# Altium project ControlBoard.PrjPcb
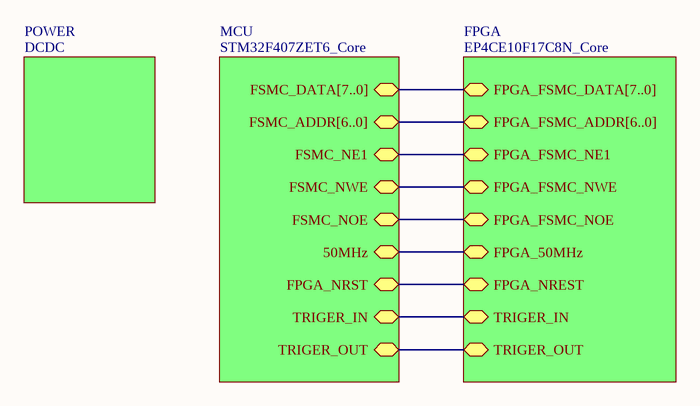
[diagram p0: Top.SchDoc]
4 sheets, 133 parts. Net scope: hierarchical (ports join the sheet entries above them; power ports are global).
Board file: ControlBoard.PcbDoc
Sheets:
  Top.SchDoc
    MCU = STM32F407ZET6_Core.SchDoc
    FPGA = EP4CE10F17C8N_Core.SchDoc
    POWER = DCDC.SchDoc

## Sheet Top.SchDoc
size A4; SheetNumber: 1; SheetTotal: 4

### Sub-sheets
FPGA = EP4CE10F17C8N_Core: FPGA_FSMC_DATA[7..0] (bidir), FPGA_50MHz (bidir), FPGA_FSMC_ADDR[6..0] (bidir), FPGA_NREST (bidir), FPGA_FSMC_NE1 (bidir), FPGA_FSMC_NWE (bidir), FPGA_FSMC_NOE (bidir), TRIGER_IN (bidir), TRIGER_OUT (bidir)
MCU = STM32F407ZET6_Core: FSMC_DATA[7..0] (bidir), 50MHz (bidir), FSMC_ADDR[6..0] (bidir), FPGA_NRST (bidir), FSMC_NE1 (bidir), FSMC_NWE (bidir), FSMC_NOE (bidir), TRIGER_IN (bidir), TRIGER_OUT (bidir)
POWER = DCDC: no entries

### Nets
FPGA_25MHZ: sheet MCU/50MHz, sheet FPGA/FPGA_50MHz
FPGA_NRST: sheet MCU/FPGA_NRST, sheet FPGA/FPGA_NREST
FSMC_NE1: sheet MCU/FSMC_NE1, sheet FPGA/FPGA_FSMC_NE1
FSMC_NOE: sheet MCU/FSMC_NOE, sheet FPGA/FPGA_FSMC_NOE
FSMC_NWE: sheet MCU/FSMC_NWE, sheet FPGA/FPGA_FSMC_NWE
TRIGER_IN: sheet MCU/TRIGER_IN, sheet FPGA/TRIGER_IN
TRIGER_OUT: sheet MCU/TRIGER_OUT, sheet FPGA/TRIGER_OUT

### Buses and harness runs
bus sheet FPGA/FPGA_FSMC_ADDR[6..0] = sheet MCU/FSMC_ADDR[6..0]
bus sheet FPGA/FPGA_FSMC_DATA[7..0] = sheet MCU/FSMC_DATA[7..0]

## Sheet STM32F407ZET6_Core.SchDoc
size A3; SheetNumber: 2; SheetTotal: 4
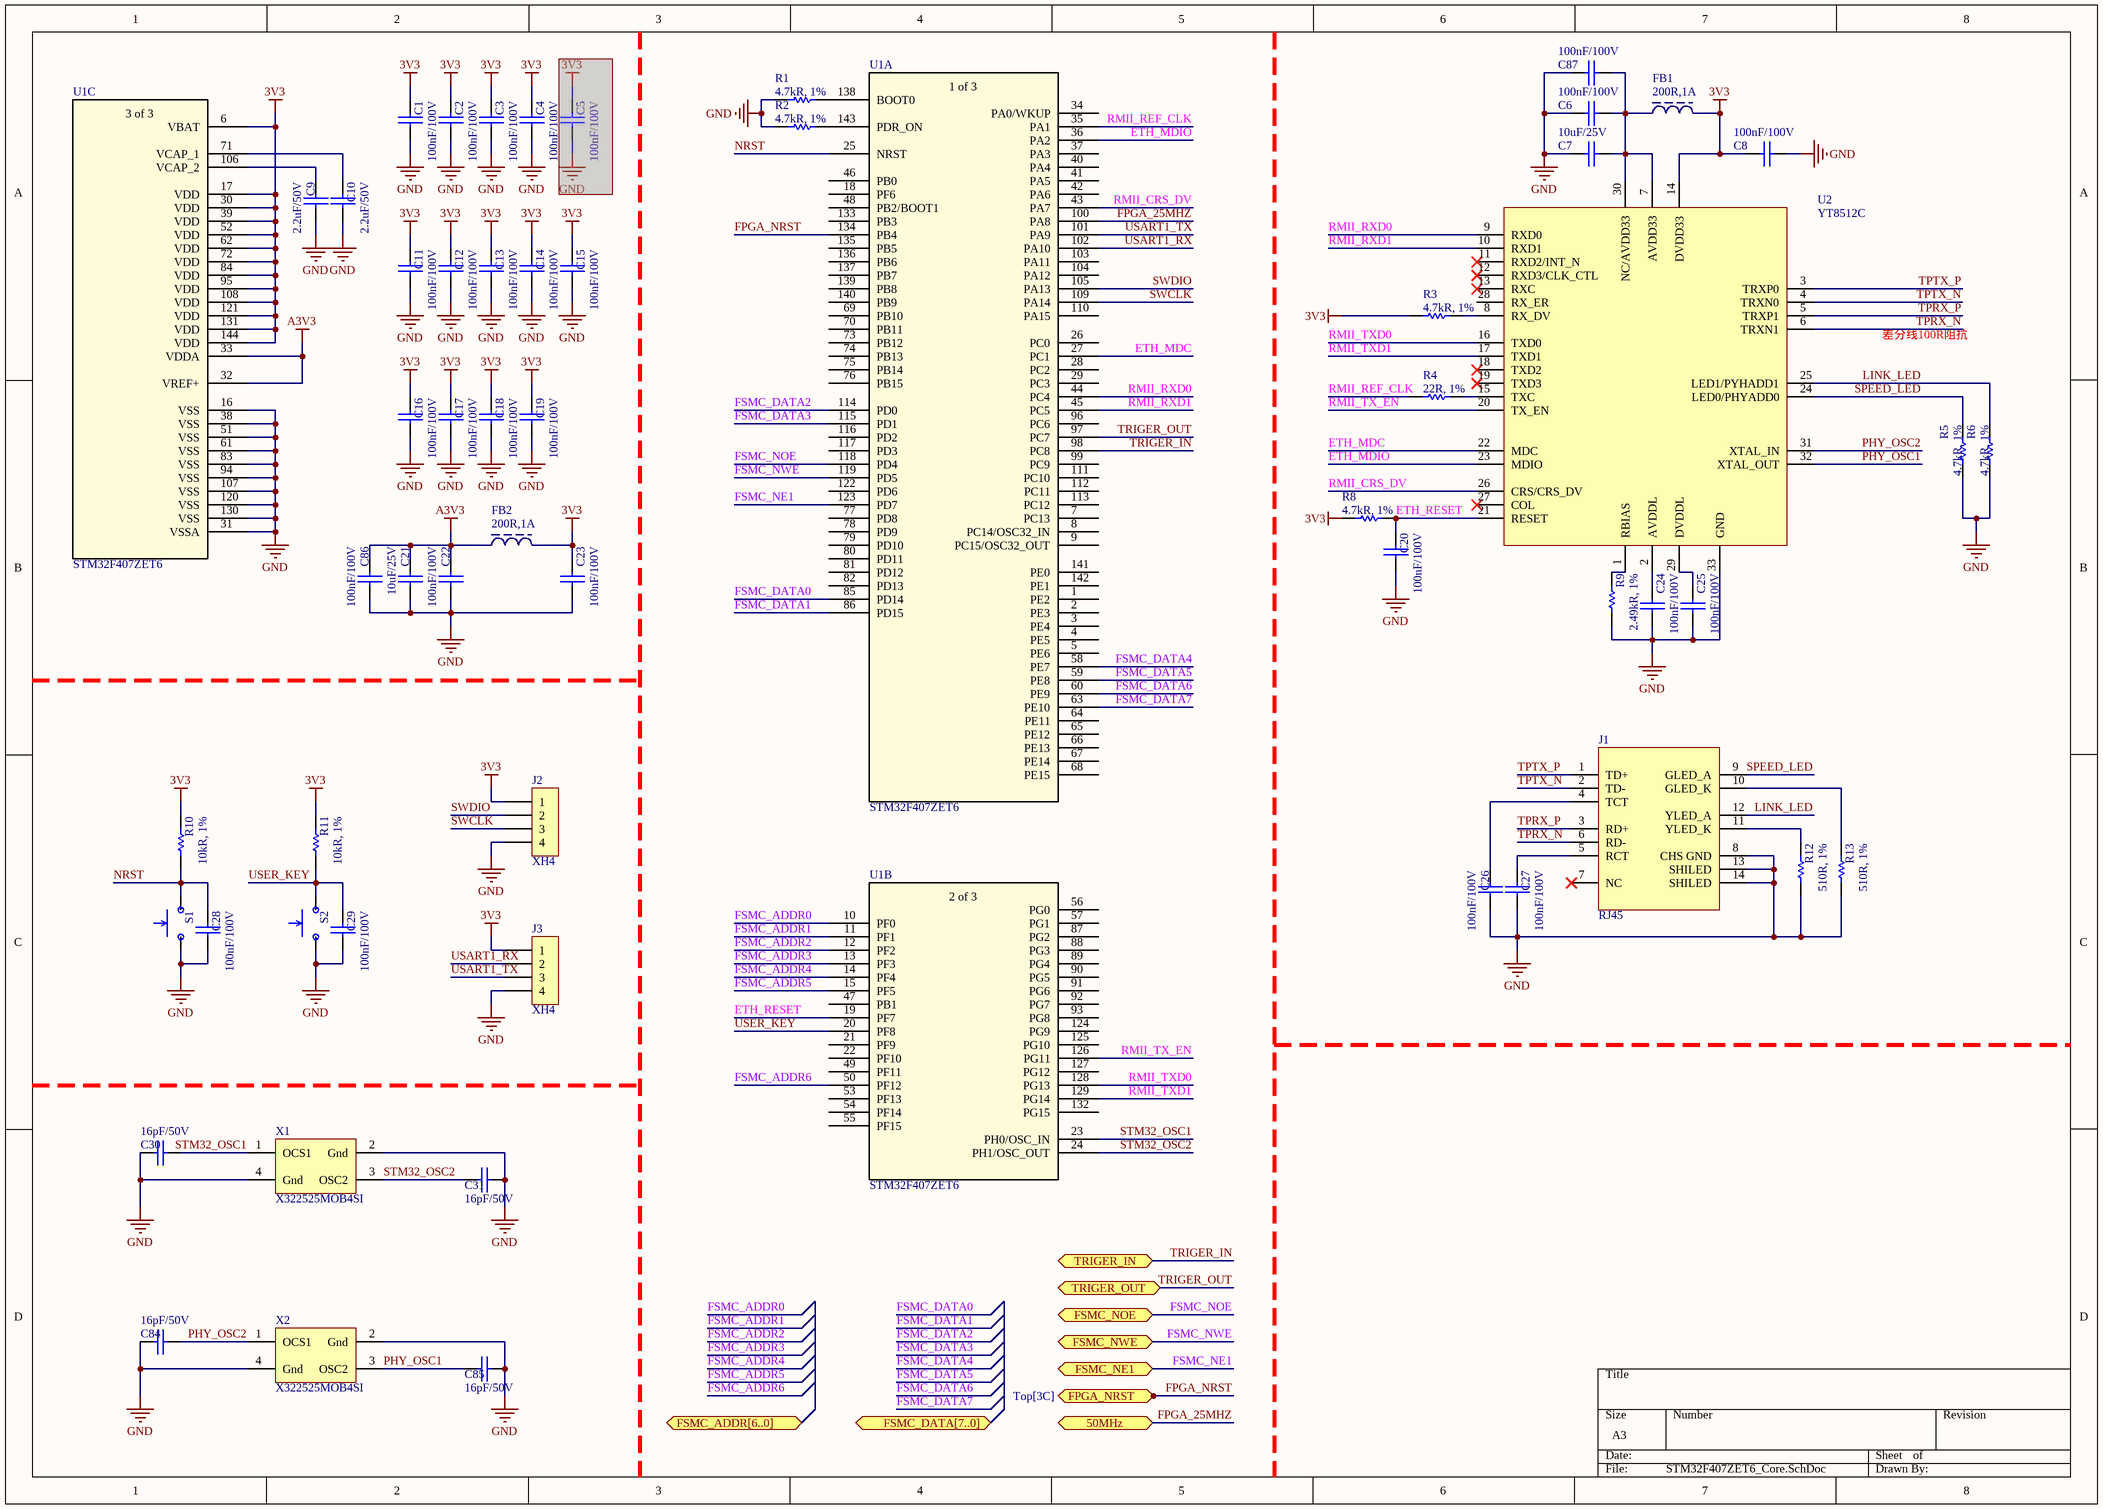
[diagram p1: STM32F407ZET6_Core.SchDoc]

### Parts
C1  100nF/100V  [0603C]
C2  100nF/100V  [0603C]
C3  100nF/100V  [0603C]
C4  100nF/100V  [0603C]
C5  100nF/100V  [0603C]  (masked out: inside a compile mask, not in the netlist)
C6  100nF/100V  [0603C]
C7  10uF/25V  [0603C]
C8  100nF/100V  [0603C]
C9  2.2uF/50V  [0603C]
C10  2.2uF/50V  [0603C]
C11  100nF/100V  [0603C]
C12  100nF/100V  [0603C]
C13  100nF/100V  [0603C]
C14  100nF/100V  [0603C]
C15  100nF/100V  [0603C]
C16  100nF/100V  [0603C]
C17  100nF/100V  [0603C]
C18  100nF/100V  [0603C]
C19  100nF/100V  [0603C]
C20  100nF/100V  [0603C]
C21  10uF/25V  [0603C]
C22  100nF/100V  [0603C]
C23  100nF/100V  [0603C]
C24  100nF/100V  [0603C]
C25  100nF/100V  [0603C]
C26  100nF/100V  [0603C]
C27  100nF/100V  [0603C]
C28  100nF/100V  [0603C]
C29  100nF/100V  [0603C]
C30  16pF/50V  [0603C]
C31  16pF/50V  [0603C]
C84  16pF/50V  [0603C]
C85  16pF/50V  [0603C]
C86  100nF/100V  [0603C]
C87  100nF/100V  [0603C]
FB1  200R,1A  [0603]
FB2  200R,1A  [0603]
J1  RJ45  [1105A_HAN]
J2  XH4  [XH4/2.54mm/180]
J3  XH4  [XH4/2.54mm/180]
R1  4.7kR, 1%  [0603R]
R2  4.7kR, 1%  [0603R]
R3  4.7kR, 1%  [0603R]
R4  22R, 1%  [0603R]
R5  4.7kR, 1%  [0603R]
R6  4.7kR, 1%  [0603R]
R8  4.7kR, 1%  [0603R]
R9  2.49kR, 1%  [0603R]
R10  10kR, 1%  [0603R]
R11  10kR, 1%  [0603R]
R12  510R, 1%  [0603R]
R13  510R, 1%  [0603R]
S1  Key  [SW-SMD]  (value not drawn)
S2  Key  [SW-SMD]  (value not drawn)
U1  STM32F407ZET6  [LQFP144-20x20mm]  (parts A,B,C of 3)
U2  YT8512C  [QFN32]
X1  X322525MOB4SI  [SMD3225-4]
X2  X322525MOB4SI  [SMD3225-4]

### Ports
50MHz (bidir, see Top[3C]), FPGA_NRST (bidir, see Top[3C]), FSMC_ADDR[6..0] (bidir, see Top[3B]), FSMC_DATA[7..0] (bidir, see Top[3B]), FSMC_NE1 (bidir, see Top[3B]), FSMC_NOE (bidir, see Top[3B]), FSMC_NWE (bidir, see Top[3B]), TRIGER_IN (bidir, see Top[3C], EP4CE10F17C8N_Core[6A]), TRIGER_OUT (bidir, see Top[3C], EP4CE10F17C8N_Core[6A])

### Nets
3V3: C1.2 C2.2 C3.2 C4.2 C8.2 C11.2 C12.2 C13.2 C14.2 C15.2 C16.2 C17.2 C18.2 C19.2 C23.2 FB1.2 FB2.2 J2.1 J3.1 R3.1 R8.1 R10.1 R11.1 U1.6(VBAT) U1.17(VDD) U1.30(VDD) U1.39(VDD) U1.52(VDD) U1.62(VDD) U1.72(VDD) U1.84(VDD) U1.95(VDD) U1.108(VDD) U1.121(VDD) U1.131(VDD) U1.144(VDD) U2.14(DVDD33)
A3V3: C21.1 C22.2 C86.2 FB2.1 U1.32(VREF+) U1.33(VDDA)
GND: C1.1 C2.1 C3.1 C4.1 C6.2 C7.2 C8.1 C9.2 C10.2 C11.1 C12.1 C13.1 C14.1 C15.1 C16.1 C17.1 C18.1 C19.1 C20.2 C21.2 C22.1 C23.1 C24.2 C25.2 C26.1 C27.2 C28.1 C29.1 C30.1 C31.2 C84.1 C85.2 C86.1 C87.2 J1.8(CHS_GND) J1.13(SHILED) J1.14(SHILED) J2.4 J3.4 R1.1 R2.1 R5.2 R6.2 R9.1 R12.2 R13.2 S1.1 S2.1 U1.16(VSS) U1.31(VSSA) U1.38(VSS) U1.51(VSS) U1.61(VSS) U1.83(VSS) U1.94(VSS) U1.107(VSS) U1.120(VSS) U1.130(VSS) U2.33(GND) X1.2(Gnd) X1.4(Gnd) X2.2(Gnd) X2.4(Gnd)
ETH_MDC: U1.27(PC1) U2.22(MDC)
ETH_MDIO: U1.36(PA2) U2.23(MDIO)
ETH_RESET: C20.1 R8.2 U1.19(PF7) U2.21(RESET)
FPGA_25MHZ: U1.100(PA8) ; port 50MHz
FPGA_NRST: U1.134(PB4) ; port FPGA_NRST
FSMC_ADDR0: U1.10(PF0)
FSMC_ADDR1: U1.11(PF1)
FSMC_ADDR2: U1.12(PF2)
FSMC_ADDR3: U1.13(PF3)
FSMC_ADDR4: U1.14(PF4)
FSMC_ADDR5: U1.15(PF5)
FSMC_ADDR6: U1.50(PF12)
FSMC_DATA0: U1.85(PD14)
FSMC_DATA1: U1.86(PD15)
FSMC_DATA2: U1.114(PD0)
FSMC_DATA3: U1.115(PD1)
FSMC_DATA4: U1.58(PE7)
FSMC_DATA5: U1.59(PE8)
FSMC_DATA6: U1.60(PE9)
FSMC_DATA7: U1.63(PE10)
FSMC_NE1: U1.123(PD7) ; port FSMC_NE1
FSMC_NOE: U1.118(PD4) ; port FSMC_NOE
FSMC_NWE: U1.119(PD5) ; port FSMC_NWE
LINK_LED: J1.12(YLED_A) R6.1 U2.25(LED1/PYHADD1)
NRST: C28.2 R10.2 S1.2 U1.25(NRST)
PHY_OSC1: C85.1 U2.32(XTAL_OUT) X2.3(OSC2)
PHY_OSC2: C84.2 U2.31(XTAL_IN) X2.1(OCS1)
RMII_CRS_DV: U1.43(PA7) U2.26(CRS/CRS_DV)
RMII_REF_CLK: R4.1 U1.35(PA1)
RMII_RXD0: U1.44(PC4) U2.9(RXD0)
RMII_RXD1: U1.45(PC5) U2.10(RXD1)
RMII_TX_EN: U1.126(PG11) U2.20(TX_EN)
RMII_TXD0: U1.128(PG13) U2.16(TXD0)
RMII_TXD1: U1.129(PG14) U2.17(TXD1)
SPEED_LED: J1.9(GLED_A) R5.1 U2.24(LED0/PHYADD0)
STM32_OSC1: C30.2 U1.23(PH0/OSC_IN) X1.1(OCS1)
STM32_OSC2: C31.1 U1.24(PH1/OSC_OUT) X1.3(OSC2)
SWCLK: J2.3 U1.109(PA14)
SWDIO: J2.2 U1.105(PA13)
TPRX_N: J1.6(RD-) U2.6(TRXN1)
TPRX_P: J1.3(RD+) U2.5(TRXP1)
TPTX_N: J1.2(TD-) U2.4(TRXN0)
TPTX_P: J1.1(TD+) U2.3(TRXP0)
TRIGER_IN: U1.98(PC8) ; port TRIGER_IN
TRIGER_OUT: U1.97(PC7) ; port TRIGER_OUT
USART1_RX: J3.2 U1.102(PA10)
USART1_TX: J3.3 U1.101(PA9)
USER_KEY: C29.2 R11.2 S2.2 U1.20(PF8)
NetC6_1: C6.1 C7.1 C87.1 FB1.1 U2.7(AVDD33) U2.30(NC/AVDD33)
NetC9_1: C9.1 U1.106(VCAP_2)
NetC10_1: C10.1 U1.71(VCAP_1)
NetC24_1: C24.1 U2.2(AVDDL)
NetC25_1: C25.1 U2.29(DVDDL)
NetC26_2: C26.2 J1.4(TCT)
NetC27_1: C27.1 J1.5(RCT)
NetJ1_10: J1.10(GLED_K) R13.1
NetJ1_11: J1.11(YLED_K) R12.1
NetR1_2: R1.2 U1.138(BOOT0)
NetR2_2: R2.2 U1.143(PDR_ON)
NetR3_2: R3.2 U2.8(RX_DV)
NetR4_2: R4.2 U2.15(TXC)
NetR9_2: R9.2 U2.1(RBIAS)

Not connected (* = marked no-connect by the designer): J1 7(NC)*; U1 1(PE2) 2(PE3) 3(PE4) 4(PE5) 5(PE6) 7(PC13) 8(PC14/OSC32_IN) 9(PC15/OSC32_OUT) 18(PF6) 21(PF9) 22(PF10) 26(PC0) 28(PC2) 29(PC3) 34(PA0/WKUP) 37(PA3) 40(PA4) 41(PA5) 42(PA6) 46(PB0) 47(PB1) 48(PB2/BOOT1) 49(PF11) 53(PF13) 54(PF14) 55(PF15) 56(PG0) 57(PG1) 64(PE11) 65(PE12) 66(PE13) 67(PE14) 68(PE15) 69(PB10) 70(PB11) 73(PB12) 74(PB13) 75(PB14) 76(PB15) 77(PD8) 78(PD9) 79(PD10) 80(PD11) 81(PD12) 82(PD13) 87(PG2) 88(PG3) 89(PG4) 90(PG5) 91(PG6) 92(PG7) 93(PG8) 96(PC6) 99(PC9) 103(PA11) 104(PA12) 110(PA15) 111(PC10) 112(PC11) 113(PC12) 116(PD2) 117(PD3) 122(PD6) 124(PG9) 125(PG10) 127(PG12) 132(PG15) 133(PB3) 135(PB5) 136(PB6) 137(PB7) 139(PB8) 140(PB9) 141(PE0) 142(PE1); U2 11(RXD2/INT_N)* 12(RXD3/CLK_CTL)* 13(RXC)* 18(TXD2)* 19(TXD3)* 27(COL)* 28(RX_ER)

### Notes on the sheet
- 差分线100R阻抗
- (in symbol STM32F407ZET6, part A) 1 of 3
- (in symbol STM32F407ZET6, part B) 2 of 3
- (in symbol STM32F407ZET6, part C) 3 of 3

### Library data of the parts
C1-C6 C8 C11-C20 C22-C29 C86 C87 = CAP: CC0603KRX7R9BB104
C7 C21 = CAP: CC0603MRX5R8BB106
C9 C10 = CAP: CC0603KRX5R9BB225
C30 C31 C84 C85 = CAP: CC0603FRNPO9BN160
FB1 FB2 = 磁珠_1: PZ1608D201-1R0TF
J1 = RJ45: HR911105A HANREN
J2 J3 = XH4: ZX-XH2.54-4PZZ
R1-R3 R5 R6 R8 = RES: RC0603FR-074K7L
R4 = RES: RC0603FR-0722RL
R9 = RES: RC0603FR-072K49L
R10 R11 = RES: AC0603FR-0710KL
R12 R13 = RES: RC0603FR-07510RL
S1 S2 = SW: TS-1101-C-W
U1 = STM32F407ZET6: High-performance foundation line, Arm Cortex-M4 core with DSP and FPU, 512 Kbytes of Flash memory, 168 MHz CPU, ART Accelerator, Ethernet, FSMC; Manufacturer_Name: STMicroelectronics; Copyright: Copyright (C) 2025 Ultra Librarian. All rights reserved.; Manufacturer_Part_Number: STM32F407ZET6; Datasheet: https://www.st.com/resource/en/datasheet/stm32f405rg.pdf; RefDes: RefDes; Type: Type
U2 = YT8512C: PHY
X1 X2 = DSX321G-16M: 无源晶振

## Sheet EP4CE10F17C8N_Core.SchDoc
size A3; SheetNumber: 3; SheetTotal: 4
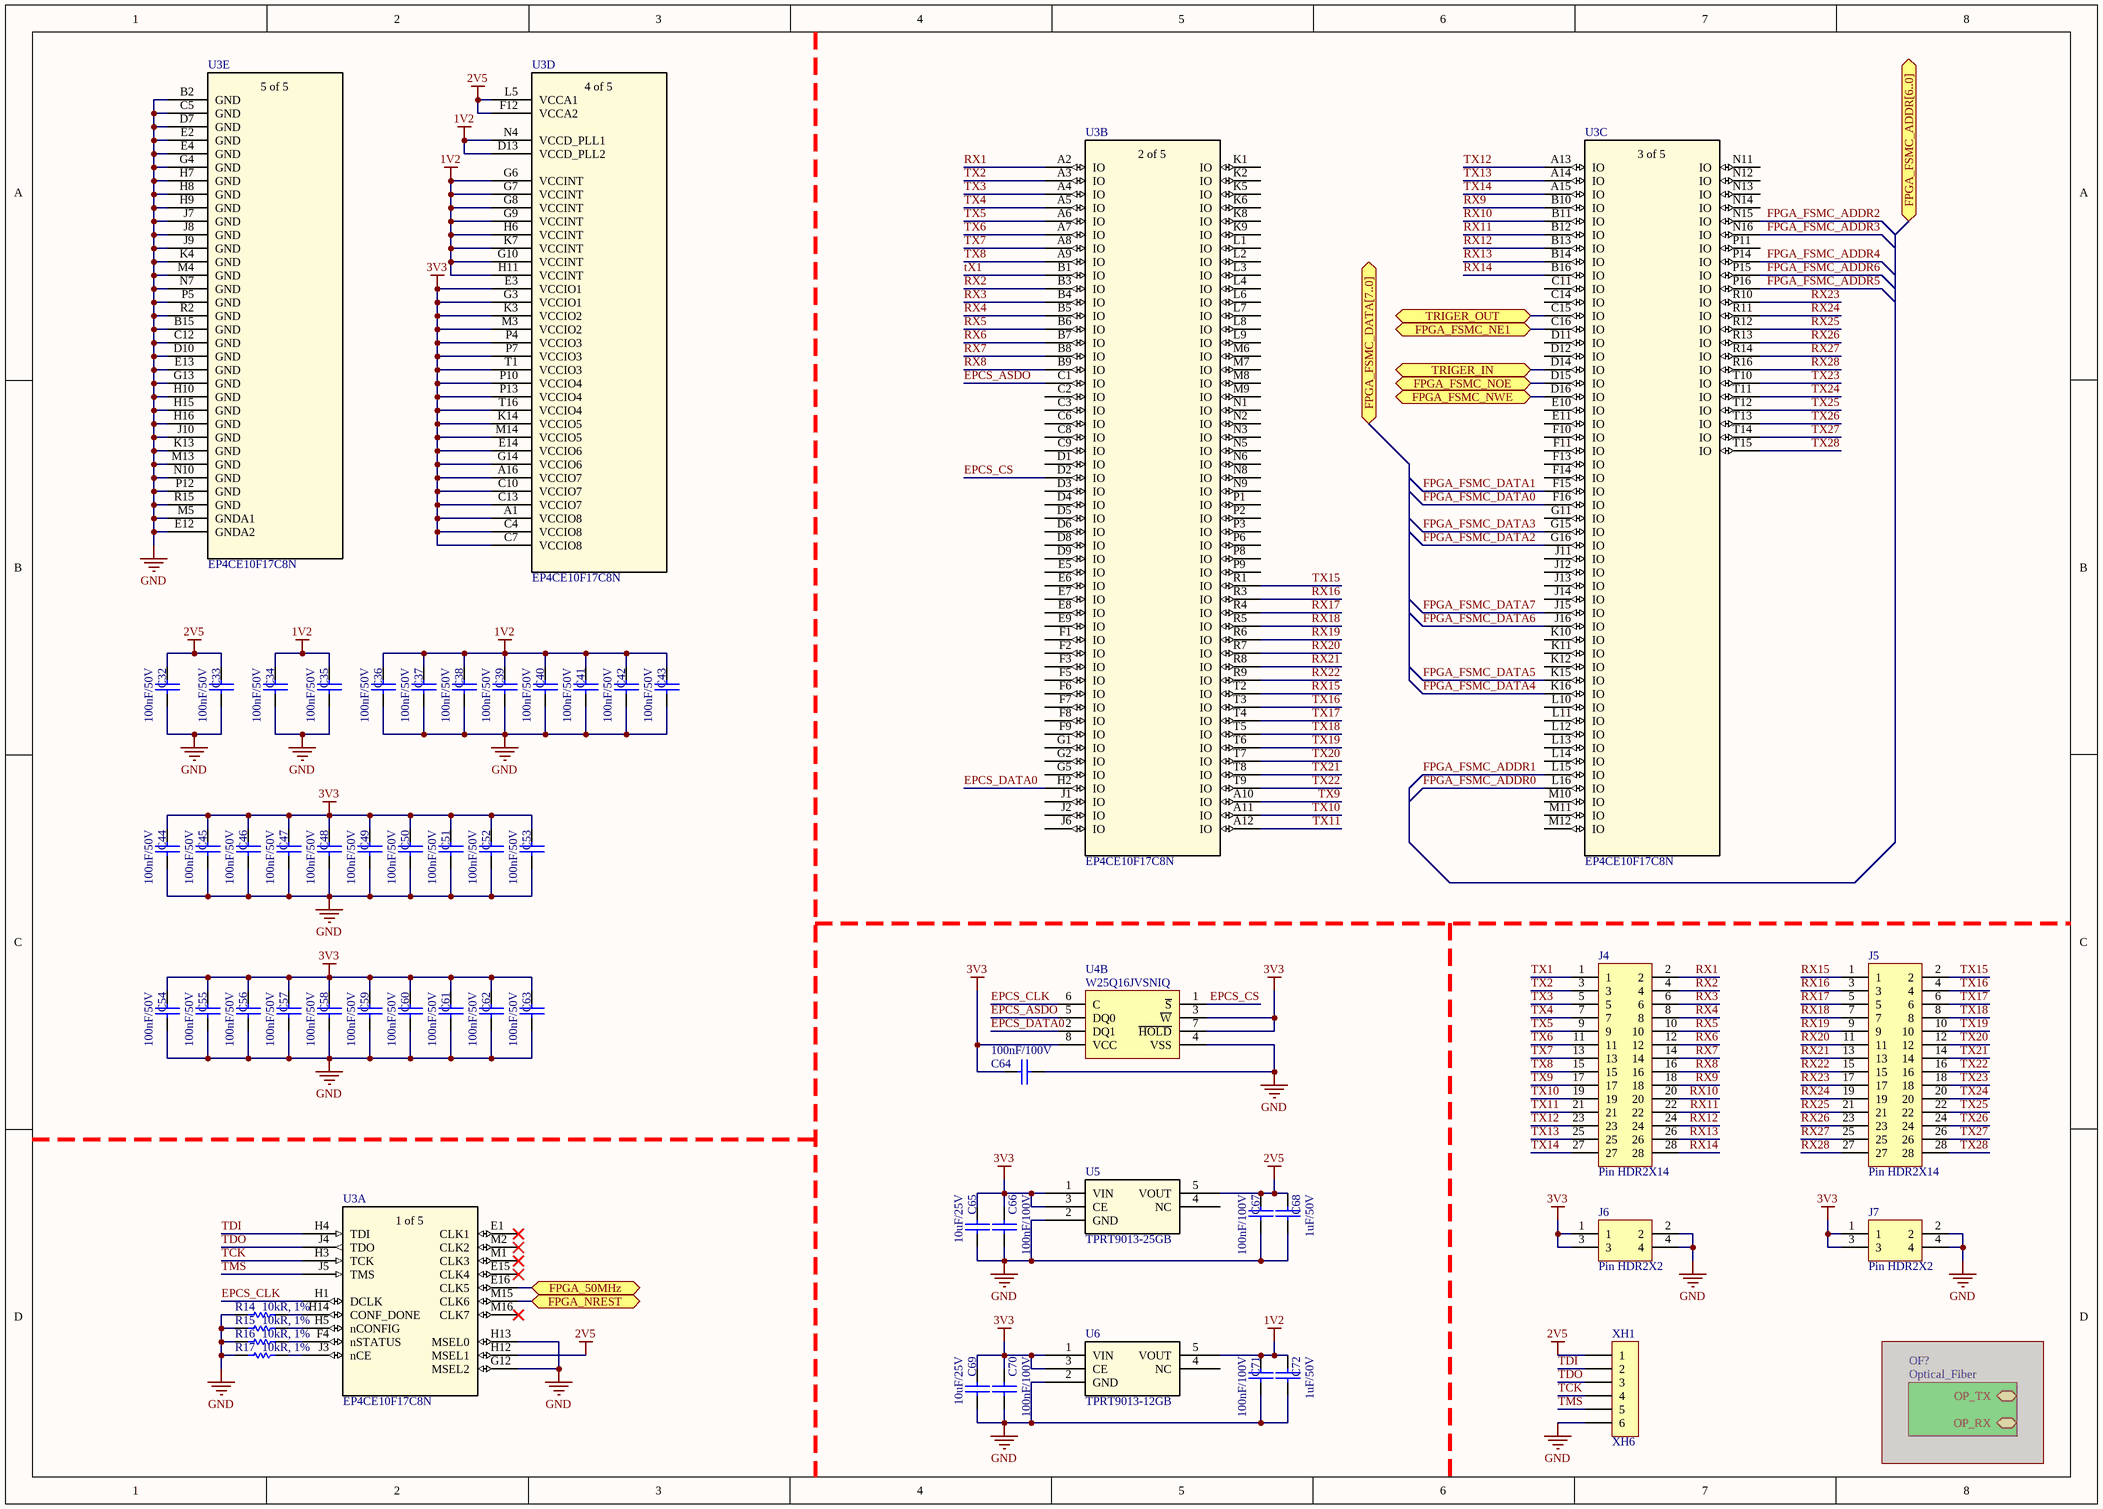
[diagram p2: EP4CE10F17C8N_Core.SchDoc]

### Parts
C32  100nF/50V  [0402C]
C33  100nF/50V  [0402C]
C34  100nF/50V  [0402C]
C35  100nF/50V  [0402C]
C36  100nF/50V  [0402C]
C37  100nF/50V  [0402C]
C38  100nF/50V  [0402C]
C39  100nF/50V  [0402C]
C40  100nF/50V  [0402C]
C41  100nF/50V  [0402C]
C42  100nF/50V  [0402C]
C43  100nF/50V  [0402C]
C44  100nF/50V  [0402C]
C45  100nF/50V  [0402C]
C46  100nF/50V  [0402C]
C47  100nF/50V  [0402C]
C48  100nF/50V  [0402C]
C49  100nF/50V  [0402C]
C50  100nF/50V  [0402C]
C51  100nF/50V  [0402C]
C52  100nF/50V  [0402C]
C53  100nF/50V  [0402C]
C54  100nF/50V  [0402C]
C55  100nF/50V  [0402C]
C56  100nF/50V  [0402C]
C57  100nF/50V  [0402C]
C58  100nF/50V  [0402C]
C59  100nF/50V  [0402C]
C60  100nF/50V  [0402C]
C61  100nF/50V  [0402C]
C62  100nF/50V  [0402C]
C63  100nF/50V  [0402C]
C64  100nF/100V  [0603C]
C65  10uF/25V  [0603C]
C66  100nF/100V  [0603C]
C67  100nF/100V  [0603C]
C68  1uF/50V  [0603C]
C69  10uF/25V  [0603C]
C70  100nF/100V  [0603C]
C71  100nF/100V  [0603C]
C72  1uF/50V  [0603C]
J4  Pin HDR2X14  [Pin HDR2X14/2.54mm-S]
J5  Pin HDR2X14  [Pin HDR2X14/2.54mm-S]
J6  Pin HDR2X2  [Pin HDR2X2/2.54mm-S]
J7  Pin HDR2X2  [Pin HDR2X2/2.54mm-S]
R14  10kR, 1%  [0402R]
R15  10kR, 1%  [0402R]
R16  10kR, 1%  [0402R]
R17  10kR, 1%  [0402R]
U3  EP4CE10F17C8N  [FBGA256]  (parts A,B,C,D,E of 5)
U4  W25Q16JVSNIQ  [SOIC8]  (part B of 2)
U5  TPRT9013-25GB  [SOT23-5]
U6  TPRT9013-12GB  [SOT23-5]
XH1  XH6  [XH6/2.54mm/180]

### Sub-sheets
OF? = Optical_Fiber (masked out) (file not in this document): OP_TX (bidir), OP_RX (bidir)

### Ports
FPGA_50MHz (bidir, see Top[3C]), FPGA_FSMC_ADDR[6..0] (bidir, see Top[3B]), FPGA_FSMC_DATA[7..0] (bidir, see Top[3B]), FPGA_FSMC_NE1 (bidir, see Top[3B]), FPGA_FSMC_NOE (bidir, see Top[3B]), FPGA_FSMC_NWE (bidir, see Top[3B]), FPGA_NREST (bidir, see Top[3C]), TRIGER_IN (bidir, see Top[3C], STM32F407ZET6_Core[5D]), TRIGER_OUT (bidir, see Top[3C], STM32F407ZET6_Core[5D])

### Nets
1V2: C34.2 C35.2 C36.2 C37.2 C38.2 C39.2 C40.2 C41.2 C42.2 C43.2 C71.2 C72.2 U3.D13(VCCD_PLL2) U3.G6(VCCINT) U3.G7(VCCINT) U3.G8(VCCINT) U3.G9(VCCINT) U3.G10(VCCINT) U3.H6(VCCINT) U3.H11(VCCINT) U3.K7(VCCINT) U3.N4(VCCD_PLL1) U6.5(VOUT)
2V5: C32.2 C33.2 C67.2 C68.2 U3.F12(VCCA2) U3.H12(MSEL1) U3.L5(VCCA1) U5.5(VOUT) XH1.1
3V3: C44.2 C45.2 C46.2 C47.2 C48.2 C49.2 C50.2 C51.2 C52.2 C53.2 C54.2 C55.2 C56.2 C57.2 C58.2 C59.2 C60.2 C61.2 C62.2 C63.2 C64.2 C65.1 C66.2 C69.1 C70.2 J6.1 J6.3 J7.1 J7.3 U3.A1(VCCIO8) U3.A16(VCCIO7) U3.C4(VCCIO8) U3.C7(VCCIO8) U3.C10(VCCIO7) U3.C13(VCCIO7) U3.E3(VCCIO1) U3.E14(VCCIO6) U3.G3(VCCIO1) U3.G14(VCCIO6) U3.K3(VCCIO2) U3.K14(VCCIO5) U3.M3(VCCIO2) U3.M14(VCCIO5) U3.P4(VCCIO3) U3.P7(VCCIO3) U3.P10(VCCIO4) U3.P13(VCCIO4) U3.T1(VCCIO3) U3.T16(VCCIO4) U4.3(~{W}) U4.7(~{HOLD}) U4.8(VCC) U5.1(VIN) U5.3(CE) U6.1(VIN) U6.3(CE)
GND: C32.1 C33.1 C34.1 C35.1 C36.1 C37.1 C38.1 C39.1 C40.1 C41.1 C42.1 C43.1 C44.1 C45.1 C46.1 C47.1 C48.1 C49.1 C50.1 C51.1 C52.1 C53.1 C54.1 C55.1 C56.1 C57.1 C58.1 C59.1 C60.1 C61.1 C62.1 C63.1 C64.1 C65.2 C66.1 C67.1 C68.1 C69.2 C70.1 C71.1 C72.1 J6.2 J6.4 J7.2 J7.4 R14.1 R15.1 R16.1 R17.1 U3.B2(GND) U3.B15(GND) U3.C5(GND) U3.C12(GND) U3.D7(GND) U3.D10(GND) U3.E2(GND) U3.E4(GND) U3.E12(GNDA2) U3.E13(GND) U3.G4(GND) U3.G12(MSEL2) U3.G13(GND) U3.H7(GND) U3.H8(GND) U3.H9(GND) U3.H10(GND) U3.H13(MSEL0) U3.H15(GND) U3.H16(GND) U3.J7(GND) U3.J8(GND) U3.J9(GND) U3.J10(GND) U3.K4(GND) U3.K13(GND) U3.M4(GND) U3.M5(GNDA1) U3.M13(GND) U3.N7(GND) U3.N10(GND) U3.P5(GND) U3.P12(GND) U3.R2(GND) U3.R15(GND) U4.4(VSS) U5.2(GND) U6.2(GND) XH1.6
EPCS_ASDO: U3.C1(IO) U4.5(DQ0)
EPCS_CLK: U3.H1(DCLK) U4.6(C)
EPCS_CS: U3.D2(IO) U4.1(~{S})
EPCS_DATA0: U3.H2(IO) U4.2(DQ1)
FPGA_25MHZ: U3.E16(CLK5) ; port FPGA_50MHz
FPGA_FSMC_ADDR0: U3.L16(IO)
FPGA_FSMC_ADDR1: U3.L15(IO)
FPGA_FSMC_ADDR2: U3.N15(IO)
FPGA_FSMC_ADDR3: U3.N16(IO)
FPGA_FSMC_ADDR4: U3.P14(IO)
FPGA_FSMC_ADDR5: U3.P16(IO)
FPGA_FSMC_ADDR6: U3.P15(IO)
FPGA_FSMC_DATA0: U3.F16(IO)
FPGA_FSMC_DATA1: U3.F15(IO)
FPGA_FSMC_DATA2: U3.G16(IO)
FPGA_FSMC_DATA3: U3.G15(IO)
FPGA_FSMC_DATA4: U3.K16(IO)
FPGA_FSMC_DATA5: U3.K15(IO)
FPGA_FSMC_DATA6: U3.J16(IO)
FPGA_FSMC_DATA7: U3.J15(IO)
FPGA_NRST: U3.M15(CLK6) ; port FPGA_NREST
FSMC_NE1: U3.C16(IO) ; port FPGA_FSMC_NE1
FSMC_NOE: U3.D15(IO) ; port FPGA_FSMC_NOE
FSMC_NWE: U3.D16(IO) ; port FPGA_FSMC_NWE
RX1: J4.2 U3.A2(IO)
RX2: J4.4 U3.B3(IO)
RX3: J4.6 U3.B4(IO)
RX4: J4.8 U3.B5(IO)
RX5: J4.10 U3.B6(IO)
RX6: J4.12 U3.B7(IO)
RX7: J4.14 U3.B8(IO)
RX8: J4.16 U3.B9(IO)
RX9: J4.18 U3.B10(IO)
RX10: J4.20 U3.B11(IO)
RX11: J4.22 U3.B12(IO)
RX12: J4.24 U3.B13(IO)
RX13: J4.26 U3.B14(IO)
RX14: J4.28 U3.B16(IO)
RX15: J5.1 U3.T2(IO)
RX16: J5.3 U3.R3(IO)
RX17: J5.5 U3.R4(IO)
RX18: J5.7 U3.R5(IO)
RX19: J5.9 U3.R6(IO)
RX20: J5.11 U3.R7(IO)
RX21: J5.13 U3.R8(IO)
RX22: J5.15 U3.R9(IO)
RX23: J5.17 U3.R10(IO)
RX24: J5.19 U3.R11(IO)
RX25: J5.21 U3.R12(IO)
RX26: J5.23 U3.R13(IO)
RX27: J5.25 U3.R14(IO)
RX28: J5.27 U3.R16(IO)
TCK: U3.H3(TCK) XH1.4
TDI: U3.H4(TDI) XH1.2
TDO: U3.J4(TDO) XH1.3
TMS: U3.J5(TMS) XH1.5
TRIGER_IN: U3.D14(IO) ; port TRIGER_IN
TRIGER_OUT: U3.C15(IO) ; port TRIGER_OUT
tX1: J4.1 U3.B1(IO)
TX2: J4.3 U3.A3(IO)
TX3: J4.5 U3.A4(IO)
TX4: J4.7 U3.A5(IO)
TX5: J4.9 U3.A6(IO)
TX6: J4.11 U3.A7(IO)
TX7: J4.13 U3.A8(IO)
TX8: J4.15 U3.A9(IO)
TX9: J4.17 U3.A10(IO)
TX10: J4.19 U3.A11(IO)
TX11: J4.21 U3.A12(IO)
TX12: J4.23 U3.A13(IO)
TX13: J4.25 U3.A14(IO)
TX14: J4.27 U3.A15(IO)
TX15: J5.2 U3.R1(IO)
TX16: J5.4 U3.T3(IO)
TX17: J5.6 U3.T4(IO)
TX18: J5.8 U3.T5(IO)
TX19: J5.10 U3.T6(IO)
TX20: J5.12 U3.T7(IO)
TX21: J5.14 U3.T8(IO)
TX22: J5.16 U3.T9(IO)
TX23: J5.18 U3.T10(IO)
TX24: J5.20 U3.T11(IO)
TX25: J5.22 U3.T12(IO)
TX26: J5.24 U3.T13(IO)
TX27: J5.26 U3.T14(IO)
TX28: J5.28 U3.T15(IO)
NetR14_2: R14.2 U3.H14(CONF_DONE)
NetR15_2: R15.2 U3.H5(nCONFIG)
NetR16_2: R16.2 U3.F4(nSTATUS)
NetR17_2: R17.2 U3.J3(nCE)

Not connected (* = marked no-connect by the designer): U3 C2(IO) C3(IO) C6(IO) C8(IO) C9(IO) C11(IO) C14(IO) D1(IO) D3(IO) D4(IO) D5(IO) D6(IO) D8(IO) D9(IO) D11(IO) D12(IO) E1(CLK1)* E5(IO) E6(IO) E7(IO) E8(IO) E9(IO) E10(IO) E11(IO) E15(CLK4)* F1(IO) F2(IO) F3(IO) F5(IO) F6(IO) F7(IO) F8(IO) F9(IO) F10(IO) F11(IO) F13(IO) F14(IO) G1(IO) G2(IO) G5(IO) G11(IO) J1(IO) J2(IO) J6(IO) J11(IO) J12(IO) J13(IO) J14(IO) K1(IO) K2(IO) K5(IO) K6(IO) K8(IO) K9(IO) K10(IO) K11(IO) K12(IO) L1(IO) L2(IO) L3(IO) L4(IO) L6(IO) L7(IO) L8(IO) L9(IO) L10(IO) L11(IO) L12(IO) L13(IO) L14(IO) M1(CLK3)* M2(CLK2)* M6(IO) M7(IO) M8(IO) M9(IO) M10(IO) M11(IO) M12(IO) M16(CLK7)* N1(IO) N2(IO) N3(IO) N5(IO) N6(IO) N8(IO) N9(IO) N11(IO) N12(IO) N13(IO) N14(IO) P1(IO) P2(IO) P3(IO) P6(IO) P8(IO) P9(IO) P11(IO); U5 4(NC); U6 4(NC)

### Notes on the sheet
- (in symbol EP4CE10F17C8N, part A) 1 of 5
- (in symbol EP4CE10F17C8N, part B) 2 of 5
- (in symbol EP4CE10F17C8N, part C) 3 of 5
- (in symbol EP4CE10F17C8N, part D) 4 of 5
- (in symbol EP4CE10F17C8N, part E) 5 of 5

### Library data of the parts
C32-C63 = CAP: CC0402KRX7R9BB104
C64 C66 C67 C70 C71 = CAP: CC0603KRX7R9BB104
C65 C69 = CAP: CC0603MRX5R8BB106
C68 C72 = CAP: CC0603KRX7R9BB105
R14-R17 = RES: RC0402FR-0710KL
U3 = EP4CE10F17C8N: No Description Available; Manufacturer_Name: Intel; Copyright: Copyright (C) 2025 Ultra Librarian. All rights reserved.; Manufacturer_Part_Number: EP4CE10F17C8N; RefDes: RefDes; Type: Type
U4 = W25Q16
U5 U6 = TPRT9013-XXGB: No Description Available; Manufacturer_Name: Tech Public; Manufacturer_Part_Number: TPRT9013-33GB; Type: Power Management; Copyright: Copyright (C) 2025 Ultra Librarian. All rights reserved.; RefDes: RefDes

## Sheet DCDC.SchDoc
size A4; SheetNumber: 4; SheetTotal: 4
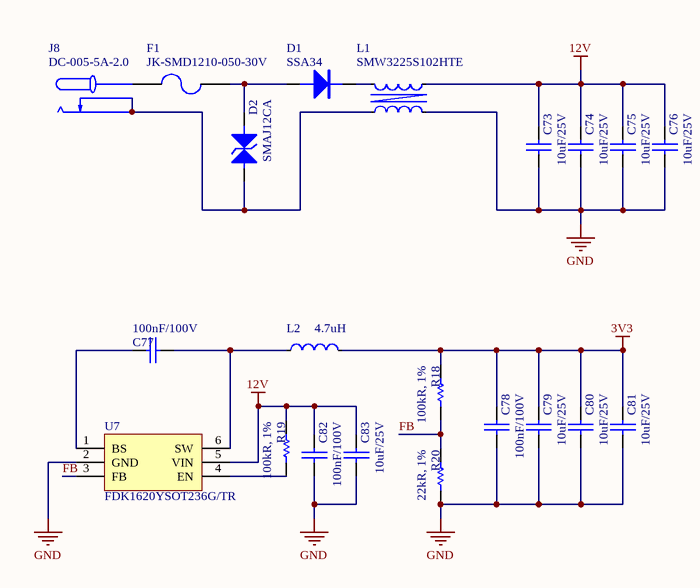
[diagram p3: DCDC.SchDoc]

### Parts
C73  10uF/25V  [0603C]
C74  10uF/25V  [0603C]
C75  10uF/25V  [0603C]
C76  10uF/25V  [0603C]
C77  100nF/100V  [0603C]
C78  100nF/100V  [0603C]
C79  10uF/25V  [0603C]
C80  10uF/25V  [0603C]
C81  10uF/25V  [0603C]
C82  100nF/100V  [0603C]
C83  10uF/25V  [0603C]
D1  SSA34  [SMA/DO-214AC]
D2  SMAJ12CA  [SMA/DO-214AC]
F1  JK-SMD1210-050-30V  [FUSE-1210]
J8  DC-005-5A-2.0  [DC-IN-TH_DC-005-5A-2.0]
L1  SMW3225S102HTE  [INDDFN4_320X250X240L65X80N]
L2  4.7uH  [L0420]
R18  100kR, 1%  [0603R]
R19  100kR, 1%  [0603R]
R20  22kR, 1%  [0603R]
U7  FDK1620YSOT236G/TR  [SOT23-6]

### Nets
3V3: C78.2 C79.2 C80.2 C81.2 L2.2 R18.1
12V: C73.2 C74.2 C75.2 C76.2 C82.2 C83.2 L1.4 R19.1 U7.5(VIN)
GND: C73.1 C74.1 C75.1 C76.1 C78.1 C79.1 C80.1 C81.1 C82.1 C83.1 L1.3 R20.2 U7.2(GND)
FB: R18.2 R20.1 U7.3(FB)
NetC77_1: C77.1 L2.1 U7.6(SW)
NetC77_2: C77.2 U7.1(BS)
NetD1_A: D1.A D2.K F1.2
NetD1_K: D1.K L1.1
NetD2_A: D2.A J8.2 J8.3 L1.2
NetF1_1: F1.1 J8.1
NetR19_2: R19.2 U7.4(EN)

### Library data of the parts
C73-C76 C79-C81 C83 = CAP: CC0603MRX5R8BB106
C77 C78 C82 = CAP: CC0603KRX7R9BB104
D1 = DIODE: 普通二极管
D2 = TVS
F1 = FUSE
J8 = DC-005-5A-2.0: Manufacturer: XKB Connection(中国星坤); Add into BOM: yes; Connector Type: DC电源插座; Inside Contact Diameter: 2mm; Outside Contact Diameter: 6.2mm; Current Rating (Max): 5A; Voltage Rating (Max): 24V; Symbol: DC-005-5A-2.0; Device: DC-005-5A-2.0; LCSC Part Name: DC电源插座 内径:2mm 外径:6.2mm; Supplier Part: C381116; Manufacturer Part: DC-005-5A-2.0; Supplier Footprint: 插件; JLCPCB Part Class: Extended Part; Datasheet: https://atta.szlcsc.com/upload/public/pdf/source/20211015/707A35F7AB6E89C57AAB641950105BB7.pdf; Supplier: LCSC; Convert to PCB: yes; Mounting Style: 弯插; Operating Temperature Range: -20℃~+70℃
L1 = SMW3225S102HTE: 1.2A; Manufacturer: cjiang(长江微电); Symbol: FXL0530-100-M; Add into BOM: yes; Value: 10uH; Tolerance: ±20%; Rated Current: 3.2A; Saturation Current (Isat): 3.5A; DC Resistance (DCR): 125mΩ; Type: 一体成型电感; Device: FXL0530-100-M; LCSC Part Name: 10uH ±20% 3.5A; Supplier Part: C177248; Manufacturer Part: FXL0530-100-M; Supplier Footprint: SMD,5.2x5.4mm; JLCPCB Part Class: Extended Part; Datasheet: https://atta.szlcsc.com/upload/public/pdf/source/20240426/3189EA8206330E2108542F9E34E540E7.pdf; Supplier: LCSC; Convert to PCB: yes
L2 = FXL0420-4R7-M: Manufacturer: cjiang(长江微电); Symbol: FXL0530-100-M; Add into BOM: yes; Value: 10uH; Tolerance: ±20%; Rated Current: 3.2A; Saturation Current (Isat): 3.5A; DC Resistance (DCR): 125mΩ; Type: 一体成型电感; Device: FXL0530-100-M; LCSC Part Name: 10uH ±20% 3.5A; Supplier Part: C177248; Manufacturer Part: FXL0530-100-M; Supplier Footprint: SMD,5.2x5.4mm; JLCPCB Part Class: Extended Part; Datasheet: https://atta.szlcsc.com/upload/public/pdf/source/20240426/3189EA8206330E2108542F9E34E540E7.pdf; Supplier: LCSC; Convert to PCB: yes
R18 R19 = RES: RC0603FR-07100KL
R20 = RES: RC0603FR-0722KL
U7 = FDK1620YSOT236G/TR: DC/DC Converter

## Nets that join several sheets
3V3: STM32F407ZET6_Core (37 pins), EP4CE10F17C8N_Core (56 pins), DCDC (6 pins)
GND: STM32F407ZET6_Core (63 pins), EP4CE10F17C8N_Core (88 pins), DCDC (13 pins)
FPGA_25MHZ: STM32F407ZET6_Core (U1.100), EP4CE10F17C8N_Core (U3.E16)
FPGA_NRST: STM32F407ZET6_Core (U1.134), EP4CE10F17C8N_Core (U3.M15)
FSMC_NE1: STM32F407ZET6_Core (U1.123), EP4CE10F17C8N_Core (U3.C16)
FSMC_NOE: STM32F407ZET6_Core (U1.118), EP4CE10F17C8N_Core (U3.D15)
FSMC_NWE: STM32F407ZET6_Core (U1.119), EP4CE10F17C8N_Core (U3.D16)
TRIGER_IN: STM32F407ZET6_Core (U1.98), EP4CE10F17C8N_Core (U3.D14)
TRIGER_OUT: STM32F407ZET6_Core (U1.97), EP4CE10F17C8N_Core (U3.C15)